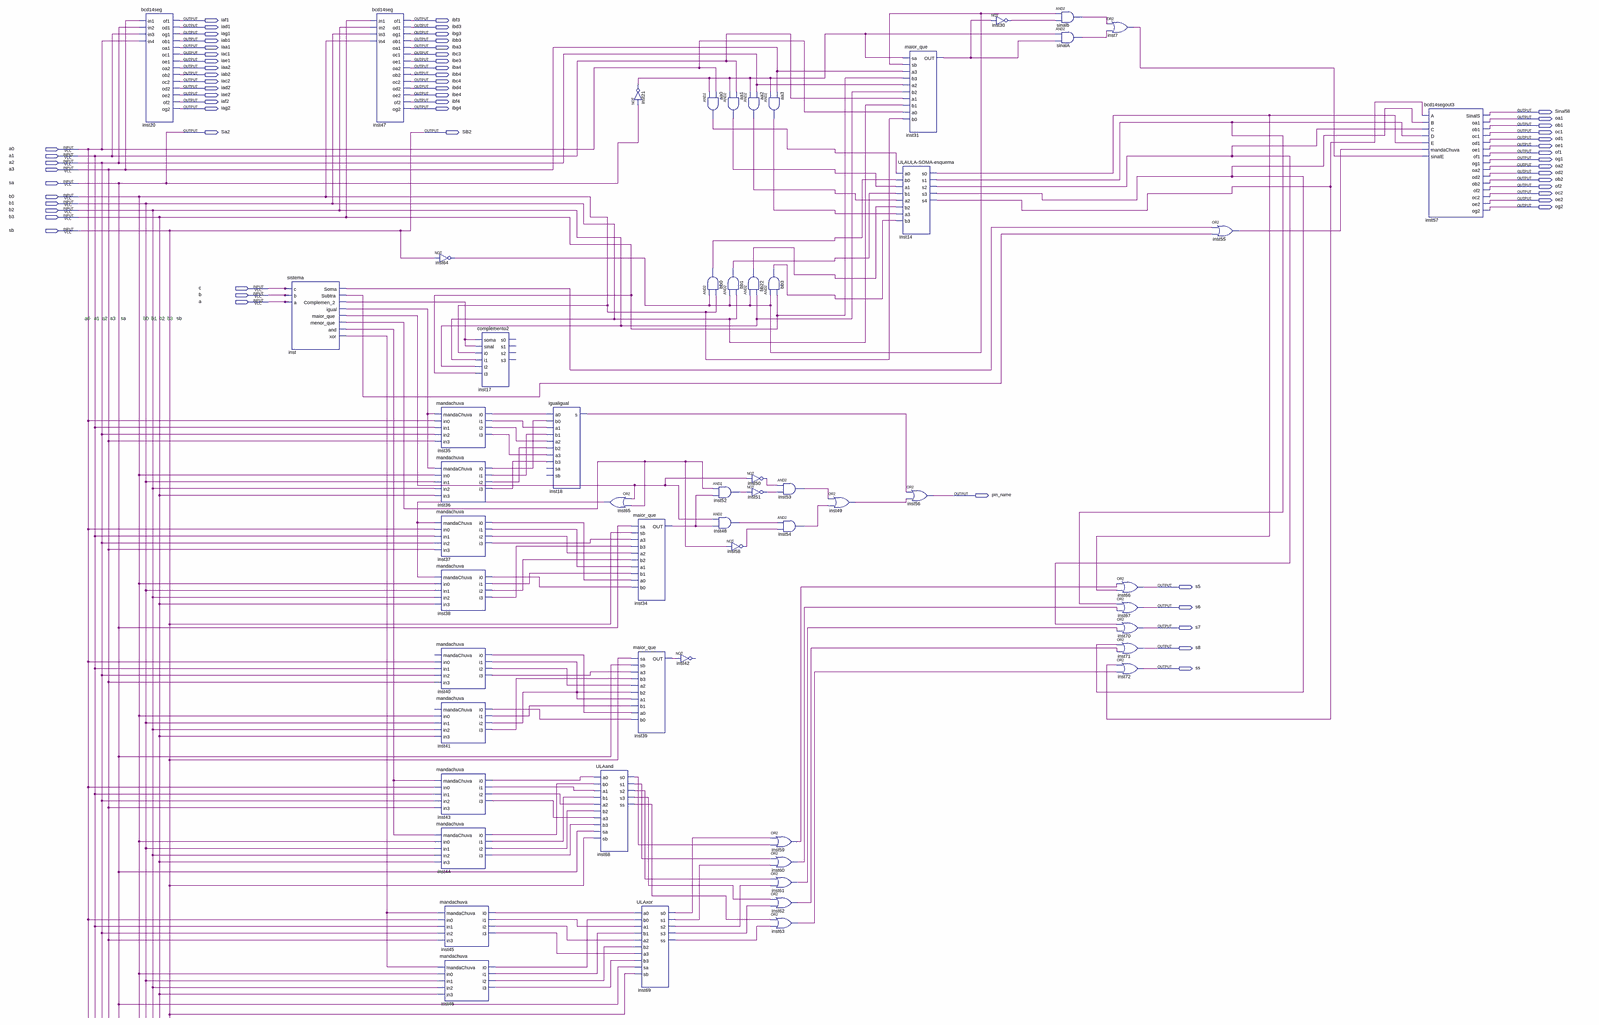
[diagram p0: schematic sheet, whole]
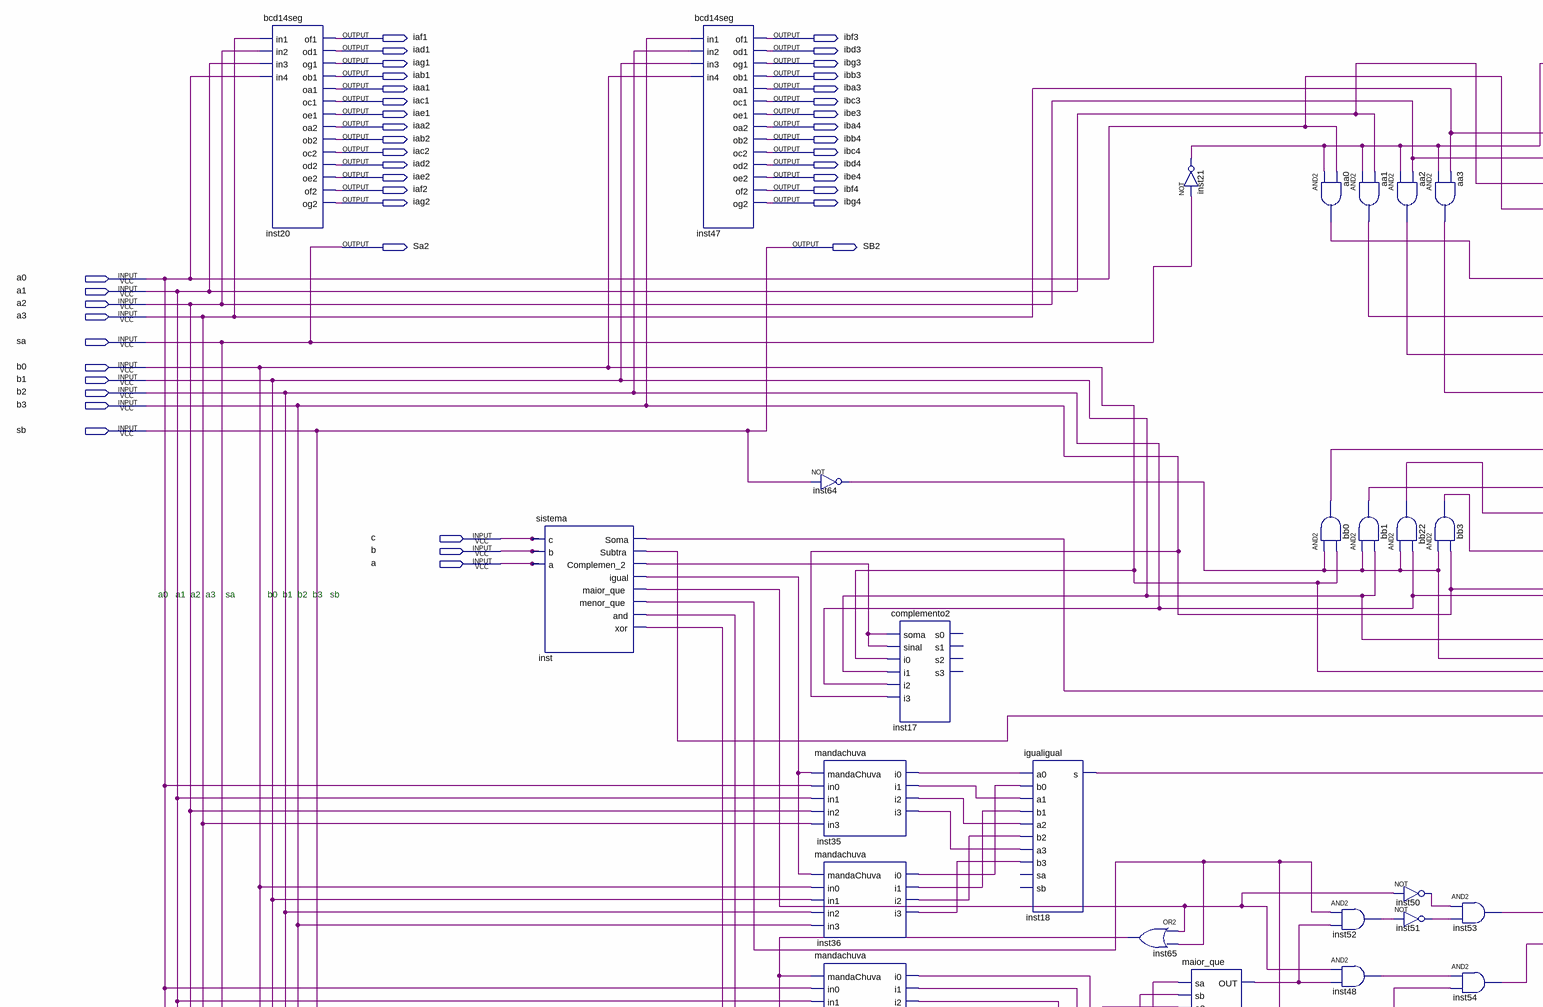
[diagram p1: schematic sheet, upper left part]
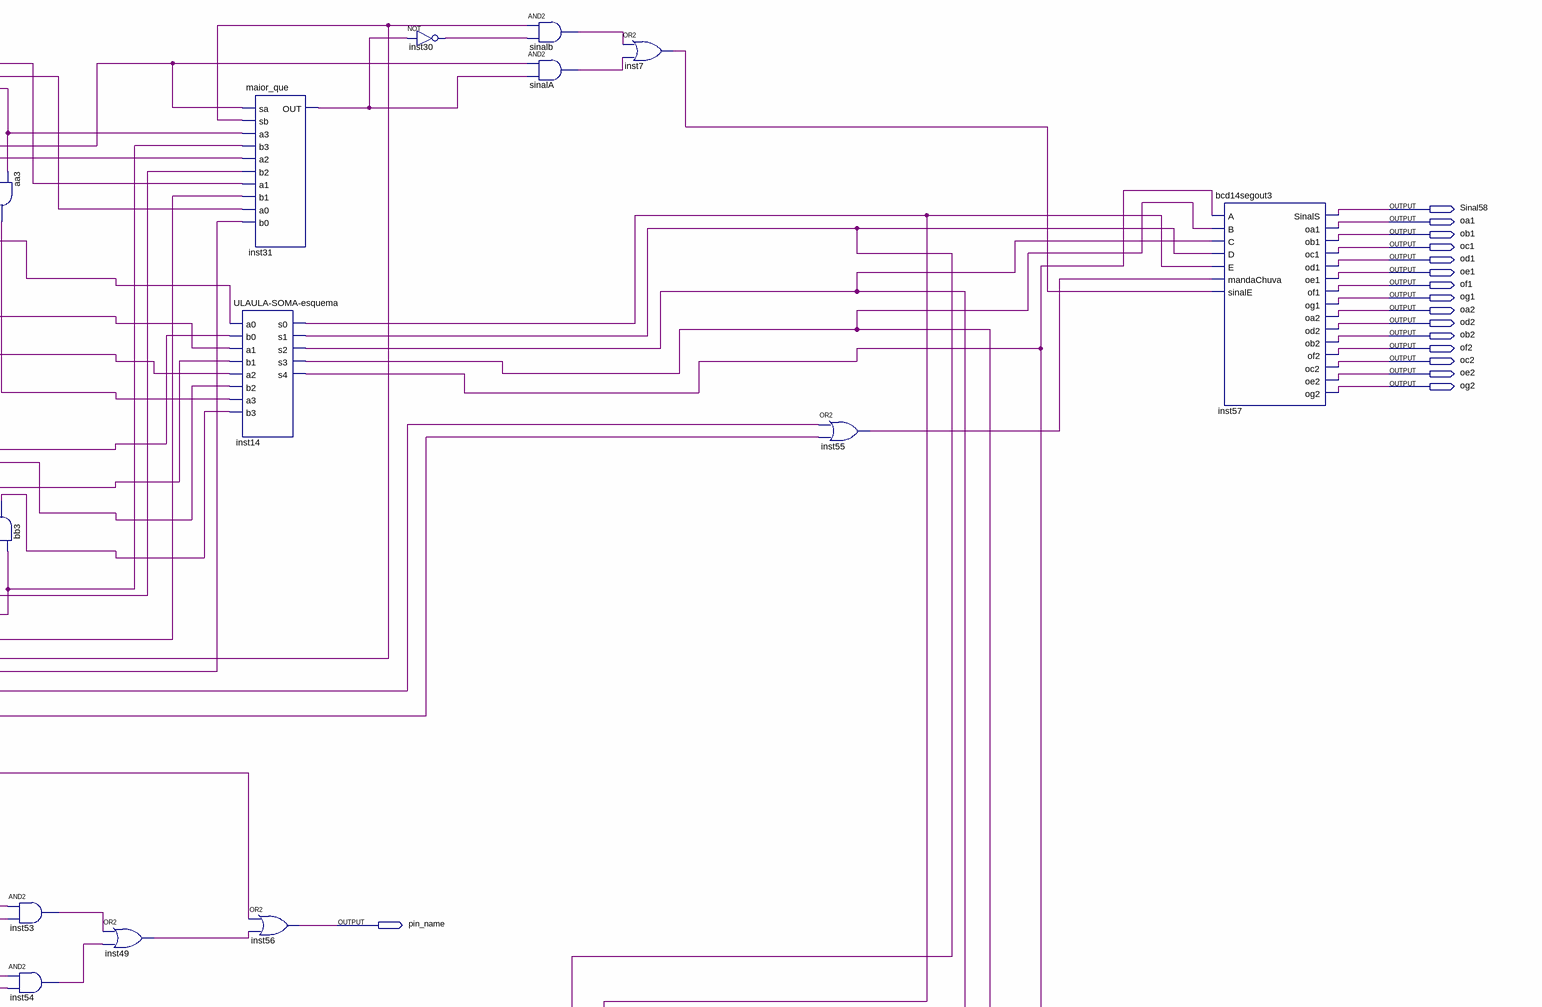
[diagram p2: schematic sheet, upper right part]
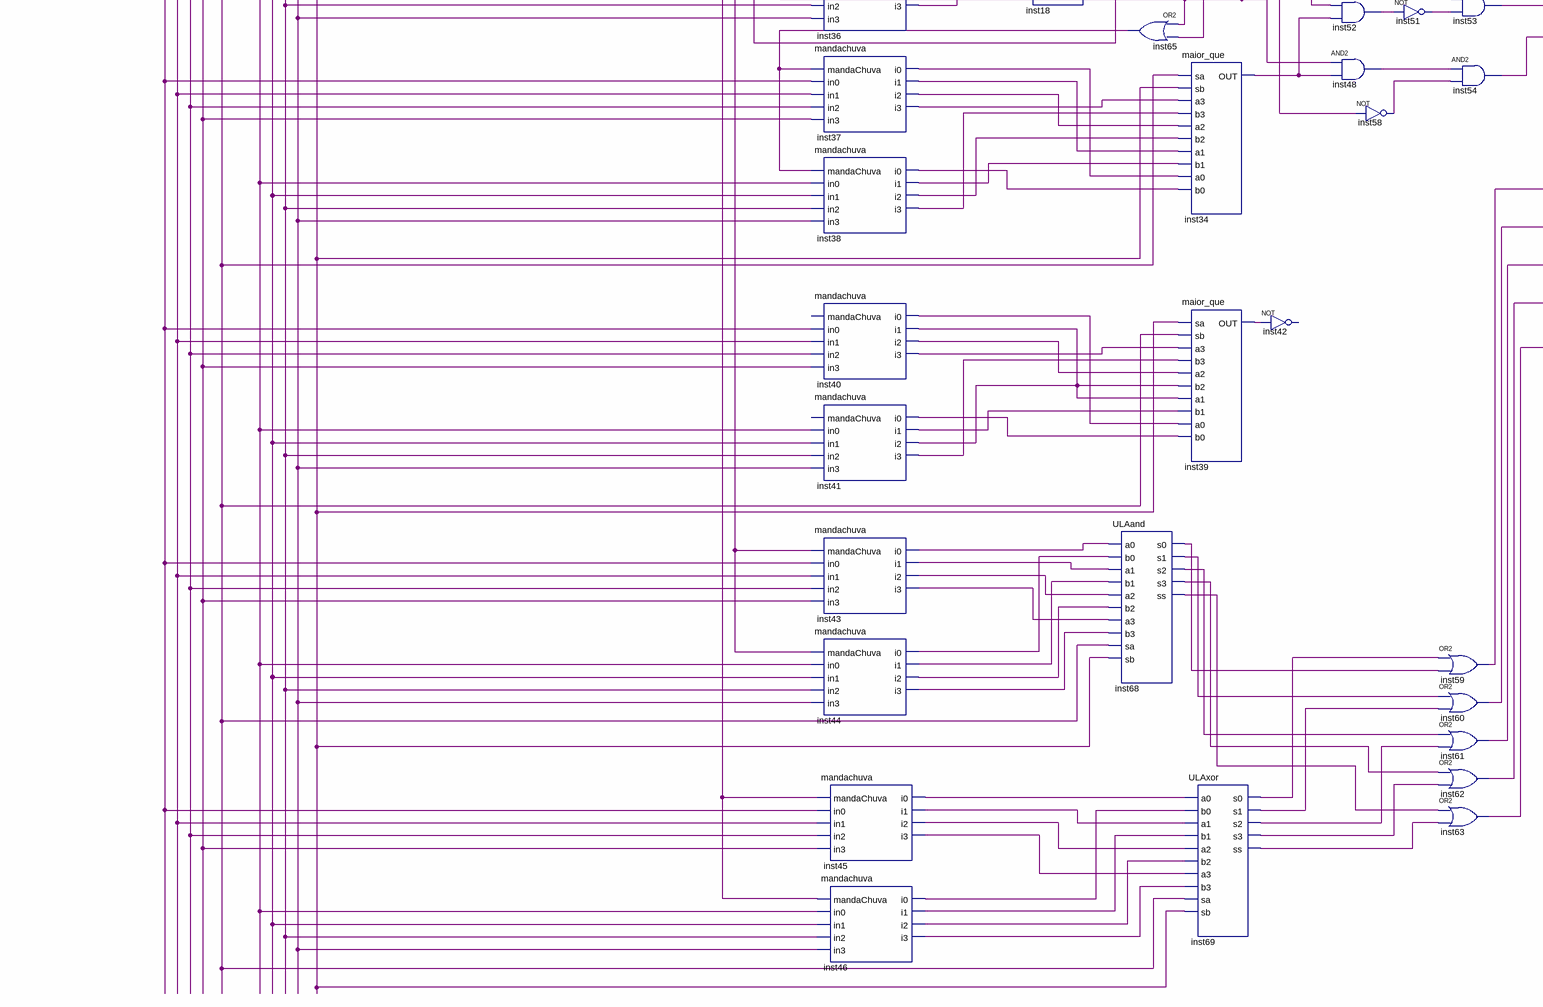
[diagram p3: schematic sheet, lower left part]
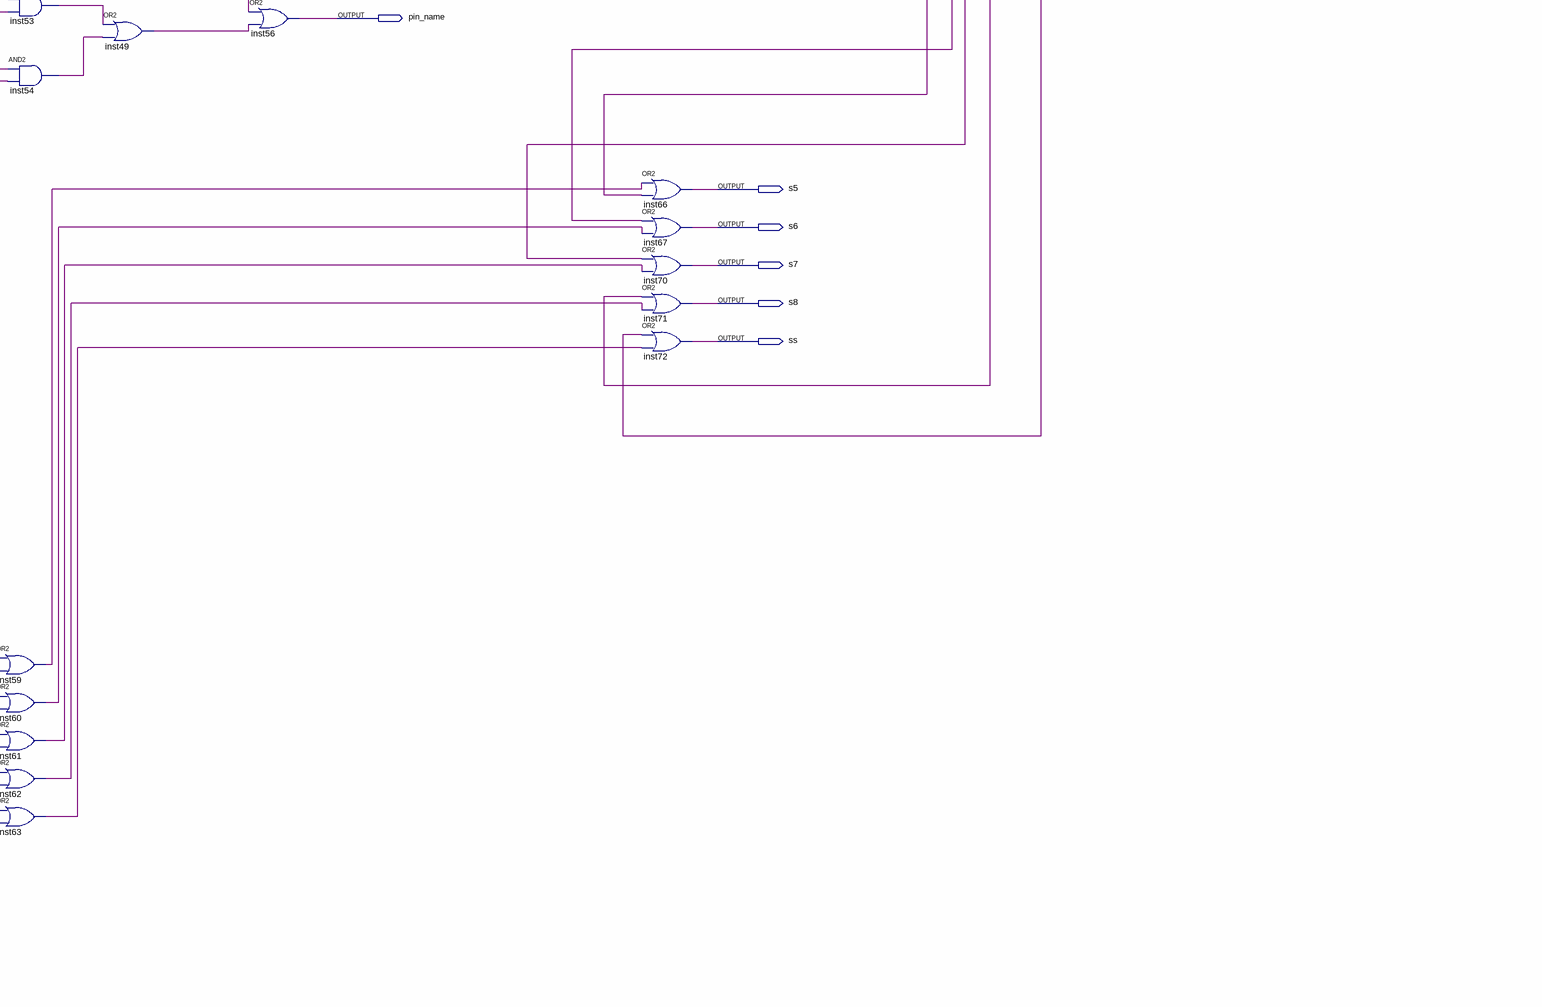
[diagram p4: schematic sheet, lower right part]
// Quartus schematic ULA_soma_14-04-19.bdf as structural Verilog: 58 symbols, 64 pins
module \ULA_soma_14-04-19  (
  input  a0,
  input  a1,
  input  a2,
  input  a3,
  input  sa,
  input  b0,
  input  b1,
  input  b2,
  input  b3,
  input  sb,
  input  c,
  input  b,
  input  a,
  output iaf1,
  output ibf3,
  output iad1,
  output ibd3,
  output iag1,
  output ibg3,
  output iab1,
  output ibb3,
  output iaa1,
  output iba3,
  output iac1,
  output ibc3,
  output iae1,
  output ibe3,
  output iaa2,
  output iba4,
  output iab2,
  output ibb4,
  output iac2,
  output ibc4,
  output iad2,
  output ibd4,
  output iae2,
  output ibe4,
  output iaf2,
  output ibf4,
  output iag2,
  output ibg4,
  output Sinal58,
  output oa1,
  output ob1,
  output Sa2,
  output SB2,
  output oc1,
  output od1,
  output oe1,
  output of1,
  output og1,
  output oa2,
  output od2,
  output ob2,
  output of2,
  output oc2,
  output oe2,
  output og2,
  output pin_name,
  output s5,
  output s6,
  output s7,
  output s8,
  output ss
);

  wire aa0_out, aa1_out, aa2_out, aa3_out, bb0_out, bb1_out, bb3_out, bb22_out, inst7_out, inst14_s0,
       inst14_s1, inst14_s2, inst14_s3, inst14_s4, inst18_s, inst21_out, inst30_out, inst31_out, inst34_out,
       inst35_i0, inst35_i1, inst35_i2, inst35_i3, inst36_i0, inst36_i1, inst36_i2, inst36_i3, inst37_i0,
       inst37_i1, inst37_i2, inst37_i3, inst38_i0, inst38_i1, inst38_i2, inst38_i3, inst39_out, inst40_i0,
       inst40_i1, inst40_i2, inst40_i3, inst41_i0, inst41_i1, inst41_i3, inst43_i0, inst43_i1, inst43_i2,
       inst43_i3, inst44_i0, inst44_i1, inst44_i2, inst44_i3, inst45_i0, inst45_i1, inst45_i2, inst45_i3,
       inst46_i0, inst46_i1, inst46_i2, inst46_i3, inst48_out, inst49_out, inst50_out, inst51_out,
       inst52_out, inst53_out, inst54_out, inst55_out, inst58_out, inst59_out, inst60_out, inst61_out,
       inst62_out, inst63_out, inst64_out, inst65_out, inst68_s0, inst68_s1, inst68_s2, inst68_s3, inst68_ss,
       inst69_s0, inst69_s1, inst69_s2, inst69_s3, inst69_ss, inst_and, inst_complemen_2, inst_igual,
       inst_maior_que, inst_menor_que, inst_soma, inst_subtra, inst_xor, sinalA_out, sinalb_out;

  bcd14seg inst20 (
    .in1(a3), .in2(a2), .in3(a1), .in4(a0), .of1(iaf1), .od1(iad1), .og1(iag1), .ob1(iab1), .oa1(iaa1),
    .oc1(iac1), .oe1(iae1), .oa2(iaa2), .ob2(iab2), .oc2(iac2), .od2(iad2), .oe2(iae2), .of2(iaf2), .og2(iag2));
  sistema inst (
    .c(c), .b(b), .a(a), .Soma(inst_soma), .Subtra(inst_subtra), .Complemen_2(inst_complemen_2),
    .igual(inst_igual), .maior_que(inst_maior_que), .menor_que(inst_menor_que), .\and (inst_and),
    .\xor (inst_xor));
  bcd14seg inst47 (
    .in1(b3), .in2(b2), .in3(b1), .in4(b0), .of1(ibf3), .od1(ibd3), .og1(ibg3), .ob1(ibb3), .oa1(iba3),
    .oc1(ibc3), .oe1(ibe3), .oa2(iba4), .ob2(ibb4), .oc2(ibc4), .od2(ibd4), .oe2(ibe4), .of2(ibf4), .og2(ibg4));
  not inst64 (inst64_out, sb);
  mandachuva inst35 (
    .mandaChuva(inst_igual), .in0(a0), .in1(a1), .in2(a2), .in3(a3), .i0(inst35_i0), .i1(inst35_i1),
    .i2(inst35_i2), .i3(inst35_i3));
  mandachuva inst36 (
    .mandaChuva(inst_igual), .in0(b0), .in1(b1), .in2(b2), .in3(b3), .i0(inst36_i0), .i1(inst36_i1),
    .i2(inst36_i2), .i3(inst36_i3));
  mandachuva inst37 (
    .mandaChuva(inst65_out), .in0(a0), .in1(a1), .in2(a2), .in3(a3), .i0(inst37_i0), .i1(inst37_i1),
    .i2(inst37_i2), .i3(inst37_i3));
  mandachuva inst38 (
    .mandaChuva(inst65_out), .in0(b0), .in1(b1), .in2(b2), .in3(b3), .i0(inst38_i0), .i1(inst38_i1),
    .i2(inst38_i2), .i3(inst38_i3));
  mandachuva inst40 (
    .in0(a0), .in1(a1), .in2(a2), .in3(a3), .i0(inst40_i0), .i1(inst40_i1), .i2(inst40_i2), .i3(inst40_i3));  // open: mandaChuva
  mandachuva inst41 (
    .in0(b0), .in1(b1), .in2(b2), .in3(b3), .i0(inst41_i0), .i1(inst41_i1), .i2(inst40_i1), .i3(inst41_i3));  // open: mandaChuva
  mandachuva inst43 (
    .mandaChuva(inst_and), .in0(a0), .in1(a1), .in2(a2), .in3(a3), .i0(inst43_i0), .i1(inst43_i1),
    .i2(inst43_i2), .i3(inst43_i3));
  mandachuva inst44 (
    .mandaChuva(inst_and), .in0(b0), .in1(b1), .in2(b2), .in3(b3), .i0(inst44_i0), .i1(inst44_i1),
    .i2(inst44_i2), .i3(inst44_i3));
  mandachuva inst45 (
    .mandaChuva(inst_xor), .in0(a0), .in1(a1), .in2(a2), .in3(a3), .i0(inst45_i0), .i1(inst45_i1),
    .i2(inst45_i2), .i3(inst45_i3));
  mandachuva inst46 (
    .mandaChuva(inst_xor), .in0(b0), .in1(b1), .in2(b2), .in3(b3), .i0(inst46_i0), .i1(inst46_i1),
    .i2(inst46_i2), .i3(inst46_i3));
  complemento2 inst17 (
    .soma(inst_complemen_2), .sinal(inst_complemen_2), .i0(b0), .i1(b1), .i2(b2), .i3(b3));  // open: s0, s1, s2, s3
  igualigual inst18 (
    .a0(inst35_i0), .b0(inst36_i0), .a1(inst35_i1), .b1(inst36_i1), .a2(inst35_i2), .b2(inst36_i2),
    .a3(inst35_i3), .b3(inst36_i3), .s(inst18_s));  // open: sa, sb
  or inst65 (inst65_out, inst_maior_que, inst_menor_que);
  ULAand inst68 (
    .a0(inst43_i0), .b0(inst44_i0), .a1(inst43_i1), .b1(inst44_i1), .a2(inst43_i2), .b2(inst44_i2),
    .a3(inst43_i3), .b3(inst44_i3), .sa(sa), .sb(sb), .s0(inst68_s0), .s1(inst68_s1), .s2(inst68_s2),
    .s3(inst68_s3), .ss(inst68_ss));
  not inst21 (inst21_out, sa);
  maior_que inst34 (
    .sa(sa), .sb(sb), .a3(inst37_i3), .b3(inst38_i3), .a2(inst37_i2), .b2(inst38_i2), .a1(inst37_i1),
    .b1(inst38_i1), .a0(inst37_i0), .b0(inst38_i0), .OUT(inst34_out));
  maior_que inst39 (
    .sa(sb), .sb(sa), .a3(inst40_i3), .b3(inst41_i3), .a2(inst40_i2), .b2(inst40_i1), .a1(inst40_i1),
    .b1(inst41_i1), .a0(inst40_i0), .b0(inst41_i0), .OUT(inst39_out));
  ULAxor inst69 (
    .a0(inst45_i0), .b0(inst46_i0), .a1(inst45_i1), .b1(inst46_i1), .a2(inst45_i2), .b2(inst46_i2),
    .a3(inst45_i3), .b3(inst46_i3), .sa(sa), .sb(sb), .s0(inst69_s0), .s1(inst69_s1), .s2(inst69_s2),
    .s3(inst69_s3), .ss(inst69_ss));
  // NOT inst42 has open pins: IN=inst39_out, OUT=open
  and aa0 (aa0_out, inst21_out, a0);
  and bb0 (bb0_out, inst64_out, b0);
  and inst52 (inst52_out, inst_menor_que, inst34_out);
  and inst48 (inst48_out, inst_maior_que, inst34_out);
  and aa1 (aa1_out, inst21_out, a1);
  and aa2 (aa2_out, inst21_out, a2);
  and bb1 (bb1_out, inst64_out, b1);
  and bb22 (bb22_out, inst64_out, b2);
  not inst58 (inst58_out, inst_menor_que);
  and aa3 (aa3_out, inst21_out, a3);
  and bb3 (bb3_out, inst64_out, b3);
  not inst50 (inst50_out, inst_maior_que);
  not inst51 (inst51_out, inst52_out);
  or inst59 (inst59_out, inst69_s0, inst68_s0);
  or inst60 (inst60_out, inst68_s1, inst69_s1);
  or inst61 (inst61_out, inst68_s2, inst69_s2);
  or inst62 (inst62_out, inst68_s3, inst69_s3);
  or inst63 (inst63_out, inst68_ss, inst69_ss);
  and inst53 (inst53_out, inst50_out, inst51_out);
  and inst54 (inst54_out, inst48_out, inst58_out);
  or inst49 (inst49_out, inst53_out, inst54_out);
  maior_que inst31 (
    .sa(inst21_out), .sb(inst64_out), .a3(a3), .b3(b3), .a2(a2), .b2(b2), .a1(a1), .b1(b1), .a0(a0), .b0(b0),
    .OUT(inst31_out));
  \ULAULA-SOMA-esquema  inst14 (
    .a0(aa0_out), .b0(bb0_out), .a1(aa1_out), .b1(bb1_out), .a2(aa2_out), .b2(bb22_out), .a3(aa3_out),
    .b3(bb3_out), .s0(inst14_s0), .s1(inst14_s1), .s2(inst14_s2), .s3(inst14_s3), .s4(inst14_s4));
  or inst56 (pin_name, inst18_s, inst49_out);
  not inst30 (inst30_out, inst31_out);
  and sinalb (sinalb_out, inst64_out, inst30_out);
  and sinalA (sinalA_out, inst21_out, inst31_out);
  or inst7 (inst7_out, sinalb_out, sinalA_out);
  or inst66 (s5, inst59_out, inst14_s0);
  or inst67 (s6, inst14_s1, inst60_out);
  or inst70 (s7, inst14_s2, inst61_out);
  or inst71 (s8, inst14_s3, inst62_out);
  or inst72 (ss, inst14_s4, inst63_out);
  or inst55 (inst55_out, inst_soma, inst_subtra);
  bcd14segout3 inst57 (
    .A(inst14_s4), .B(inst14_s3), .C(inst14_s2), .D(inst14_s1), .E(inst14_s0), .mandaChuva(inst55_out),
    .sinalE(inst7_out), .SinalS(Sinal58), .oa1(oa1), .ob1(ob1), .oc1(oc1), .od1(od1), .oe1(oe1), .of1(of1),
    .og1(og1), .oa2(oa2), .od2(od2), .ob2(ob2), .of2(of2), .oc2(oc2), .oe2(oe2), .og2(og2));

  assign Sa2 = sa;
  assign SB2 = sb;

  // Notes on the sheet:
  //   a0   a1  a2  a3    sa             b0  b1  b2  b3   sb
endmodule
